# Altium schematic sheet 5_motor driver.SchDoc
size A4; SheetNumber: 5; SheetTotal: 7
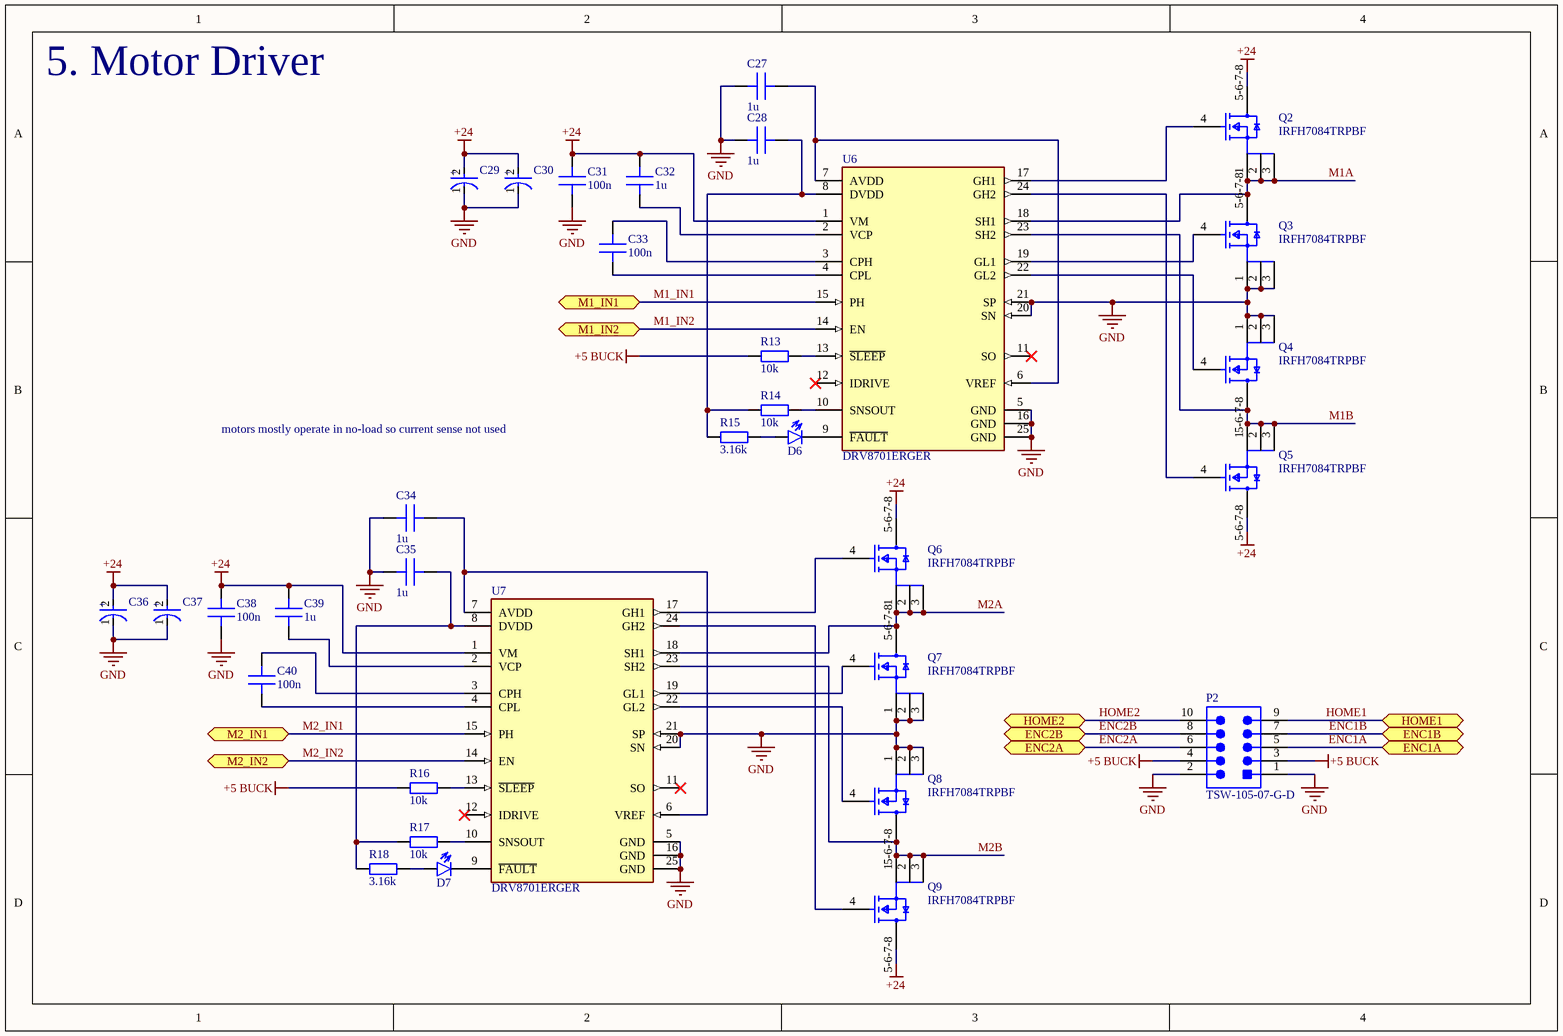
[diagram p0: 5_motor driver.SchDoc]

## Parts
C27  1u  [IPC C C0402 NO SILK]
C28  1u  [IPC C C0402 NO SILK]
C29  UCW1H221MNL1GS  [FP-UCW1H221MNL1GS-MFG]  (value not drawn)
C30  UCW1H221MNL1GS  [FP-UCW1H221MNL1GS-MFG]  (value not drawn)
C31  100n  [IPC C C0603 NO SILK]
C32  1u  [IPC C C0603 NO SILK]
C33  100n  [IPC C C0603 NO SILK]
C34  1u  [IPC C C0402 NO SILK]
C35  1u  [IPC C C0402 NO SILK]
C36  UCW1H221MNL1GS  [FP-UCW1H221MNL1GS-MFG]  (value not drawn)
C37  UCW1H221MNL1GS  [FP-UCW1H221MNL1GS-MFG]  (value not drawn)
C38  100n  [IPC C C0603 NO SILK]
C39  1u  [IPC C C0603 NO SILK]
C40  100n  [IPC C C0603 NO SILK]
D6  Red LED 0603  [IPC C D0603]  (value not drawn)
D7  Red LED 0603  [IPC C D0603]  (value not drawn)
P2  TSW-105-07-G-D  [SMTC-TSW-105-07-G-D_V]
Q2  IRFH7084TRPBF  [FP-PQFN5x6-G-MFG]
Q3  IRFH7084TRPBF  [FP-PQFN5x6-G-MFG]
Q4  IRFH7084TRPBF  [FP-PQFN5x6-G-MFG]
Q5  IRFH7084TRPBF  [FP-PQFN5x6-G-MFG]
Q6  IRFH7084TRPBF  [FP-PQFN5x6-G-MFG]
Q7  IRFH7084TRPBF  [FP-PQFN5x6-G-MFG]
Q8  IRFH7084TRPBF  [FP-PQFN5x6-G-MFG]
Q9  IRFH7084TRPBF  [FP-PQFN5x6-G-MFG]
R13  10k  [IPC C R0402 NO SILK]
R14  10k  [IPC C R0402 NO SILK]
R15  3.16k  [IPC C R0402 NO SILK]
R16  10k  [IPC C R0402 NO SILK]
R17  10k  [IPC C R0402 NO SILK]
R18  3.16k  [IPC C R0402 NO SILK]
U6  DRV8701ERGER  [FP-RGE0024F-MFG]
U7  DRV8701ERGER  [FP-RGE0024F-MFG]

## Ports
ENC1A (bidir, see 2_mcu[3D]), ENC1B (bidir, see 2_mcu[3D]), ENC2A (bidir, see 2_mcu[3C]), ENC2B (bidir, see 2_mcu[3B]), HOME1 (bidir, see 2_mcu[3C]), HOME2 (bidir, see 2_mcu[3C]), M1_IN1 (bidir, see 2_mcu[2D]), M1_IN2 (bidir, see 2_mcu[2D]), M2_IN1 (bidir, see 2_mcu[2D]), M2_IN2 (bidir, see 2_mcu[2D])

## Nets
+5 BUCK: P2.3 P2.4 R13.2 R16.2
+24: C29.2(A) C30.2(A) C31.2 C32.1 C36.2(A) C37.2(A) C38.2 C39.1 Q2.5-6-7-8(D) Q5.5-6-7-8(D) Q6.5-6-7-8(D) Q9.5-6-7-8(D) U6.1(VM) U7.1(VM)
GND: C27.1 C28.1 C29.1(C) C30.1(C) C31.1 C34.1 C35.1 C36.1(C) C37.1(C) C38.1 P2.1 P2.2 Q3.1(S) Q3.2(S) Q3.3(S) Q4.1(S) Q4.2(S) Q4.3(S) Q7.1(S) Q7.2(S) Q7.3(S) Q8.1(S) Q8.2(S) Q8.3(S) U6.5(GND) U6.16(GND) U6.20(SN) U6.21(SP) U6.25(GND) U7.5(GND) U7.16(GND) U7.20(SN) U7.21(SP) U7.25(GND)
ENC1A: P2.5 ; port ENC1A
ENC1B: P2.7 ; port ENC1B
ENC2A: P2.6 ; port ENC2A
ENC2B: P2.8 ; port ENC2B
HOME1: P2.9 ; port HOME1
HOME2: P2.10 ; port HOME2
M1_IN1: U6.15(PH) ; port M1_IN1
M1_IN2: U6.14(EN) ; port M1_IN2
M1A: Q2.1(S) Q2.2(S) Q2.3(S) Q3.5-6-7-8(D) U6.18(SH1)
M1B: Q4.5-6-7-8(D) Q5.1(S) Q5.2(S) Q5.3(S) U6.23(SH2)
M2_IN1: U7.15(PH) ; port M2_IN1
M2_IN2: U7.14(EN) ; port M2_IN2
M2A: Q6.1(S) Q6.2(S) Q6.3(S) Q7.5-6-7-8(D) U7.18(SH1)
M2B: Q8.5-6-7-8(D) Q9.1(S) Q9.2(S) Q9.3(S) U7.23(SH2)
NetC27_2: C27.2 U6.6(VREF) U6.7(AVDD)
NetC28_2: C28.2 R14.2 R15.2 U6.8(DVDD)
NetC32_2: C32.2 U6.2(VCP)
NetC33_1: C33.1 U6.3(CPH)
NetC33_2: C33.2 U6.4(CPL)
NetC34_2: C34.2 U7.6(VREF) U7.7(AVDD)
NetC35_2: C35.2 R17.2 R18.2 U7.8(DVDD)
NetC39_2: C39.2 U7.2(VCP)
NetC40_1: C40.1 U7.3(CPH)
NetC40_2: C40.2 U7.4(CPL)
NetD6_1: D6.1(A) R15.1
NetD6_2: D6.2(C) U6.9(~{FAULT})
NetD7_1: D7.1(A) R18.1
NetD7_2: D7.2(C) U7.9(~{FAULT})
NetQ2_4: Q2.4(G) U6.17(GH1)
NetQ3_4: Q3.4(G) U6.19(GL1)
NetQ4_4: Q4.4(G) U6.22(GL2)
NetQ5_4: Q5.4(G) U6.24(GH2)
NetQ6_4: Q6.4(G) U7.17(GH1)
NetQ7_4: Q7.4(G) U7.19(GL1)
NetQ8_4: Q8.4(G) U7.22(GL2)
NetQ9_4: Q9.4(G) U7.24(GH2)
NetR13_1: R13.1 U6.13(~{SLEEP})
NetR14_1: R14.1 U6.10(SNSOUT)
NetR16_1: R16.1 U7.13(~{SLEEP})
NetR17_1: R17.1 U7.10(SNSOUT)

Not connected (* = marked no-connect by the designer): U6 11(SO)* 12(IDRIVE)*; U7 11(SO)* 12(IDRIVE)*

## Notes on the sheet
- 5. Motor Driver
- motors mostly operate in no-load so current sense not used
- (in symbol CMP-12462-000041-1) +

## Library data of the parts
C27 C28 C34 C35 = Generic CAP 0402: Value: 1u
C29 C30 C36 C37 = CMP-12462-000041-1: CAP ALUM 220UF 20% 50V SMD; Dissipation Factor: 0.14%; Ripple Current: 670mA; Dielectric Material: Aluminium; Life (Hours): 7000Hour; Impedance: 350mR; Leakage Current: 3uA; Capacitance: 220uF; Max Operating Temperature: 105°C; Features: General Purpose; Voltage Rating: 50V; Case/Package: Radial; Termination: SMD/SMT; Tolerance: 20%; Package Quantity: 500; Construction: Cylindrical; REACH SVHC: No SVHC; Width: 10.3mm; Min Operating Temperature: -25°C; RoHS Compliant: Yes; Mount: Surface Mount; Diameter: 10mm; Voltage: 50V; Series: CW; Voltage Rating (DC): 50V; Ripple Current (AC): 670mA; Radiation Hardening: No; Length: 10mm; Packaging: Tape and Reel; Height: 10mm; Height - Seated (Max): 0.394inch
C31-C33 C38-C40 = Generic CAP 0603
  C31 C33 C38 C40: Value: 100n
  C32 C39: Value: 1u
D6 D7 = Generic LED 0603
P2 = CMP-2000-07330-1: Post Terminal Strip Assembly, Pitch 2.54 mm, 2 x 5 Position, Height 8.58 mm, Tail Length 2.54 mm, -55 to 125 degC, RoHS, Bulk; Manufacturer: Samtec-Inc.; Connector Type: Header,Unshrouded; Number of Positions Loaded: All; Pitch: 0.100"(2.54mm); Number of Positions: 10; Package Reference: TSW-105-07-G-D; Mounting Technology: ThroughHole; Datasheet URL: http://suddendocs.samtec.com/prints/tsw-xxx-xx-xxx-x-xx-xxx-mkt.pdf; Termination: Solder; Packaging: Bulk; Number of Rows: 2; Contact Finish: Gold; Mounting Type: ThroughHole; Features: -; Color: Black; Category: Connectors,Interconnects; Family: RectangularConnectors-Headers,MalePins; Manufacturer URL: http://www.samtec.com/; Series: TSW; Fastening Type: -; Package URL: http://suddendocs.samtec.com/prints/tsw-xxx-xx-x-x-xx-xxx-footprint.pdf; Row Spacing: 0.100"(2.54mm); Contact Mating Length: 0.230"(5.84mm); Contact Finish Thickness: 10µin(0.25µm); Contact Type: MalePin; Package Description: Male Header, Pitch 2.54 mm, 2 x 5 Position, Height 8.58 mm, Tail Length 2.54 mm; Datasheet Version: Rev. DO, 08/1988
Q2-Q9 = CMP-32901-000490-1: MOSFET N-CH 40V 100A 8QFN; Input Capacitance: 6.56nF; Threshold Voltage: 3.9V; Rds On Max: 1.25mR; Mount: Surface Mount; Drain to Source Voltage (Vdss): 40V; Max Operating Temperature: 150°C; Continuous Drain Current (ID): 100A; Min Operating Temperature: -55°C; Packaging: Tape and Reel; Max Dual Supply Voltage: 40V; Number of Pins: 8; Lead Free: Lead Free; Halogen Free: Halogen Free; REACH SVHC: No SVHC
R13-R18 = Generic RES 0402
  R13 R14 R16 R17: Value: 10k
  R15 R18: Value: 3.16k
U6 U7 = CMP-04915-000069-1: IC MOTOR DRIVER 0V-5.5V 24VQFN; Interface: Parallel; Lead Free: Lead Free; Mount: Surface Mount; Max Operating Temperature: 125°C; Min Operating Temperature: -40°C; Case/Package: VQFN; RoHS Compliant: Yes; Packaging: Tape and Reel